# Altium schematic sheet checkBattery.SchDoc
size A4; SheetNumber: 2; SheetTotal: 2
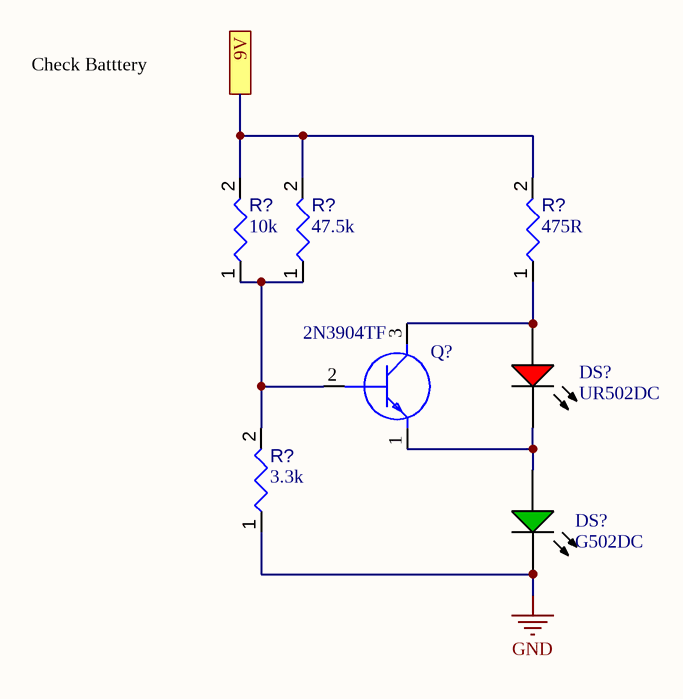
[diagram p0: checkBattery.SchDoc]

## Parts
(Parts that share a designator on the sheet are numbered #1, #2 ... from top to bottom, then left to right.)
DS?#1  UR502DC  [CGX-UR502DC]
DS?#2  G502DC  [CGX-G502DC]
Q?  2N3904TF  [BC33740TA]
R?#1  value 10k  [RESA60-630X240]  (hidden comment: MFR-25FBF52-10K)
R?#2  value 47.5k  [RESA60-630X240]  (hidden comment: MFR-25FBF52-47K5)
R?#3  value 475R  [RESA60-630X240]  (hidden comment: MFR-25FBF52-475R)
R?#4  value 3.3k  [RESA60-630X240]  (hidden comment: MFR-25FBF52-1K)

## Ports
9V

## Nets
GND: DS?#2.2(K) R?#4.1
9V: R?#1.2 R?#2.2 R?#3.2 ; port 9V
NetDS?#1_1: DS?#1.1(A) Q?.3(C) R?#3.1
NetDS?#1_2: DS?#1.2(K) DS?#2.1(A) Q?.1(E)
NetQ?_2: Q?.2(B) R?#1.1 R?#2.1 R?#4.2

## Notes on the sheet
- Check Batttery

## Library data of the parts
DS?#1 = CMP-007-00009-2: Red LED, 80 mW, 30 mA, -25 to 85 degC, 2-Pin THD; Manufacturer: Shenzhen CGX; Power: 80mW; Case/Package: UR502DC; RoHS Compliant: Unknown; Package Description: 2-Pin Through Hole Device, Dia 5.9 mm, Height 9.1 mm; Manufacturer URL: http://szcgx.com/; Datasheet Version: Sep-14; Package Reference: UR502DC; Datasheet URL: http://datasheet.octopart.com/UR502DC-Chengguangxing-datasheet-62330342.pdf; Mounting Technology: TH
DS?#2 = CMP-007-00008-2: Green LED, 80 mW, 20 mA, -25 to 85 degC, 2-Pin THD; Manufacturer: Shenzhen CGX; Mounting Technology: TH; Package Reference: G502DC; Datasheet Version: Sep-14; Manufacturer URL: http://szcgx.com/; Package Description: 2-Pin Through Hole Device, Dia 5.9 mm; Datasheet URL: http://datasheet.octopart.com/G502DC-Chengguangxing-datasheet-62330340.pdf; Case/Package: G502DC; RoHS Compliant: Unknown
Q? = 2N3904TF: Transistor BJT NPN; Manufacturer_Name: ON Semiconductor; Datasheet Link: http://www.onsemi.com/pub/Collateral/2N3904-D.pdf; Manufacturer_Part_Number: 2N3904TF; Mouser Part Number: 512-2N3904TF; Mouser Price/Stock: https://www.mouser.co.uk/ProductDetail/ON-Semiconductor-Fairchild/2N3904TF?qs=UMEuL5FsraAGLMCvg3Q72w%3D%3D; Arrow Part Number: 2N3904TF; Arrow Price/Stock: https://www.arrow.com/en/products/2n3904tf/on-semiconductor
R?#1 = CMP-009-00047-4: Axial Resistor, 10 KOhm, +/- 1%, 0.25 W, -55 to 155 degC, 2-Pin THD, RoHS, Bulk; Manufacturer: Yageo; Power: 250mW; Voltage Rating: 250V; Manufacturer URL: http://www.yageo.com/; Datasheet URL: http://www.yageo.com/documents/recent/Yageo%20LR_MFR_2013.pdf; Package Reference: MFR-25; Min Operating Temperature: -55°C; Mounting Technology: TH; Package Quantity: 200; Case/Package: Axial; Tolerance: 1%; RoHS Compliant: True; Datasheet Version: Apr-13; Packaging: Bulk; Max Operating Temperature: 155°C; Package Description: 2-Pin Axial Lead, Dia 2.4 mm, Body Length 6.3 mm
R?#2 = CMP-009-00057-4: Axial Resistor, 47.5 KOhm, +/- 1%, 0.25 W, -55 to 155 degC, 2-Pin THD, RoHS, Bulk; Manufacturer: Yageo; Voltage Rating: 250V; Power: 250mW; RoHS Compliant: True; Packaging: Bulk; Manufacturer URL: http://www.yageo.com/; Package Quantity: 200; Datasheet URL: http://www.yageo.com/documents/recent/Yageo%20LR_MFR_2013.pdf; Case/Package: Axial; Package Reference: MFR-25; Tolerance: 1%; Max Operating Temperature: 155°C; Package Description: 2-Pin Axial Lead, Dia 2.4 mm, Body Length 6.3 mm; Datasheet Version: Apr-13; Min Operating Temperature: -55°C; Mounting Technology: TH
R?#3 = CMP-009-00056-4: Axial Resistor, 475 Ohm, +/- 1%, 0.25 W, -55 to 155 degC, 2-Pin THD, RoHS, Bulk; Manufacturer: Yageo; Voltage Rating: 250V; Power: 250mW; Case/Package: Axial; Datasheet URL: http://www.yageo.com/documents/recent/Yageo%20LR_MFR_2013.pdf; Tolerance: 1%; RoHS Compliant: True; Mounting Technology: TH; Packaging: Bulk; Package Description: 2-Pin Axial Lead, Dia 2.4 mm, Body Length 6.3 mm; Max Operating Temperature: 155°C; Package Reference: MFR-25; Datasheet Version: Apr-13; Min Operating Temperature: -55°C; Package Quantity: 200; Manufacturer URL: http://www.yageo.com/
R?#4 = CMP-009-00048-4: Axial Resistor, 1 KOhm, +/- 1%, 250 mW, -55 to 155 degC, 2-Pin THD, RoHS, Bulk; Manufacturer: Yageo; Voltage Rating: 250V; Power: 250mW; Min Operating Temperature: -55°C; Max Operating Temperature: 155°C; Tolerance: 1%; Package Reference: MFR-25; Composition: CarbonFilm; Mounting Technology: TH; Packaging: Bulk; Case/Package: Axial; Datasheet URL: http://www.yageo.com/documents/recent/Yageo%20LR_MFR_2013.pdf; Package Quantity: 200; Manufacturer URL: http://www.yageo.com/; Package Description: 2-Pin Axial Lead, Dia 2.4 mm, Body Length 6.3 mm; Datasheet Version: Apr-13; RoHS Compliant: True